# Altium schematic sheet DB_LEDS_0603.SchDoc: User FPGA Status LEDs
size A4; Organization: Altium Limited.; Address1: Level 3, 12a Rodborough Rd; Address2: Frenchs Forest 2086; Address3: NSW; Address4: AUSTRALIA; DocumentNumber: 27; SheetNumber: 28; SheetTotal: 78
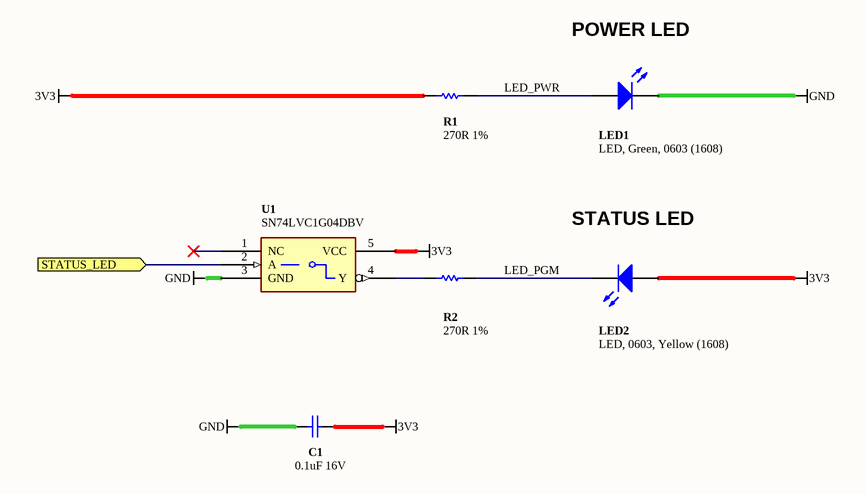
[diagram p0: DB_LEDS_0603.SchDoc]

## Parts
C1  0.1uF 16V  [CAPC1005-STAR]
LED1  LED, Green, 0603 (1608)  [0603LED_GREEN]
LED2  LED, 0603, Yellow (1608)  [0603LED_YELLOW]
R1  270R 1%  [RESC1005-STAR]
R2  270R 1%  [RESC1005-STAR]
U1  SN74LVC1G04DBV  [SOT95P280-5]

## Ports
STATUS_LED (in)

## Nets
3V3: C1.2 LED2.1(A) R1.1 U1.5(VCC)
GND: C1.1 LED1.2(K) U1.3(GND)
LED_PGM: LED2.2(K) R2.2
LED_PWR: LED1.1(A) R1.2
STATUS_LED: U1.2(A) ; port STATUS_LED
NetR2_1: R2.1 U1.4(Y)

Not connected (* = marked no-connect by the designer): U1 1(NC)*

## Notes on the sheet
- POWER LED
- (near LED2) STATUS LED
- Sheet Title
- Project Title
- Size:
- Date:
- A4
- Assy:
- Time:
- Revision:
- Sheet
- of
- File:

## Library data of the parts
C1 = D-101-0080: Capacitor, Ceramic, 0.1uF 10% 16V 0402 (1005) X7R; Polarity: Non-Polarized; Capacitance: 0.1 uF; Dielectric: X7R; Mounting Technology: Surface Mount; Rated Voltage: 16 V; Status: Production; Technology: Ceramic; Tolerance: 10 %; Category: Capacitor
LED1 = D-153-0002: Brightness: 50mcd; Peak Wave Length: nm; Category: LED; Color: Green; Mounting Technology: Surface Mount; Status: Production
LED2 = D-153-0007: Brightness: 120mcd; Color: Yellow/Amber; Peak Wave Length: nm; Category: LED; Mounting Technology: Surface Mount; Status: Production
R1 R2 = D-100-0111: Resistor, 270R 1% 0402 (1005); Power Rating: 63 mW; Mounting Technology: Surface Mount; Resistance: 270 R; Status: Production; Tolerance: 1 %; Category: Resistor
U1 = D-205-0001: SN74LVC1G04DBV, Single Inverter Gate, 1.65-V to 5.5-V; Mounting Technology: Surface Mount; Status: Production; Category: IC-Logic